# Altium schematic sheet Bomba Aire.SchDoc
size A4
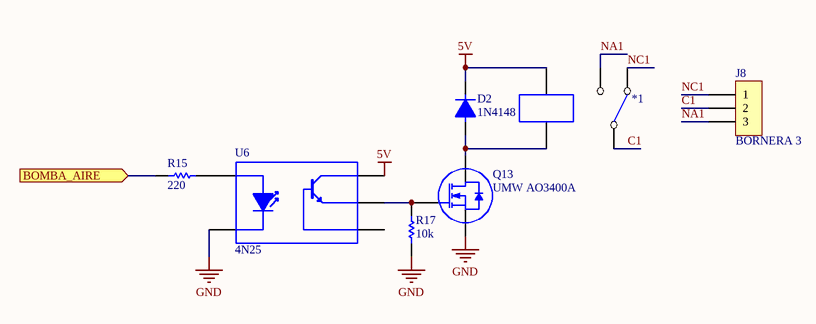
[diagram p0: Bomba Aire.SchDoc]

## Parts
*1  RELE SIMPLE  [RELE SERIE 964]  (value not drawn)
D2  1N4148  [1206K]
J8  BORNERA 3  [BORNERA3]
Q13  UMW AO3400A  [SOT23]
R15  220  [0805]
R17  10k  [0805]
U6  4N25  [SMD6]

## Ports
BOMBA_AIRE (in)

## Nets
5V: *1.B1 D2.2 U6.5(C)
GND: Q13.3(S) R17.1 U6.2(K)
BOMBA_AIRE: R15.1 ; port BOMBA_AIRE
C1: *1.C1 J8.2
NA1: *1.NA1 J8.3
NC1: *1.NC1 J8.1
Net*1_B2: *1.B2 D2.1 Q13.2(D)
NetQ13_1: Q13.1(G) R17.2 U6.4(E)
NetR15_2: R15.2 U6.1(A)

Not connected (* = marked no-connect by the designer): U6 6(B)

## Library data of the parts
D2 = DIODO
Q13 = MOSFET N
R15 R17 = RES